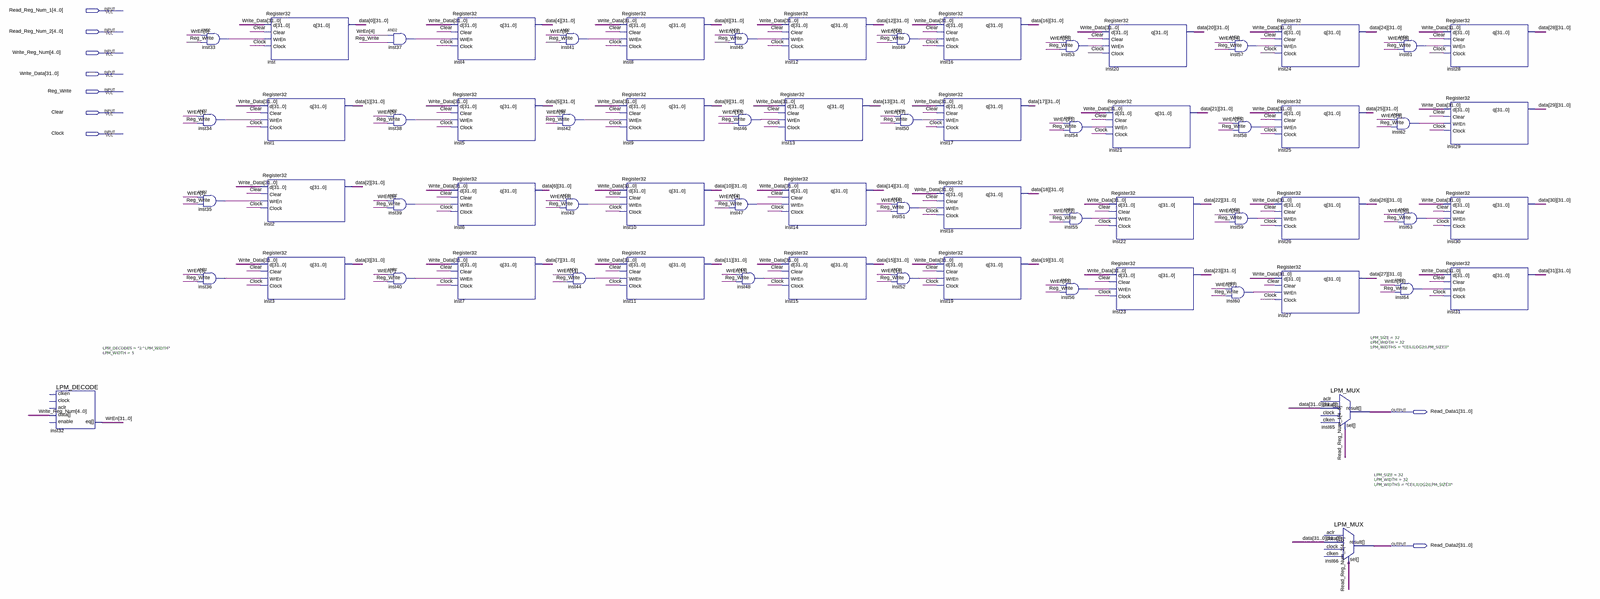
[diagram p0: schematic sheet, whole]
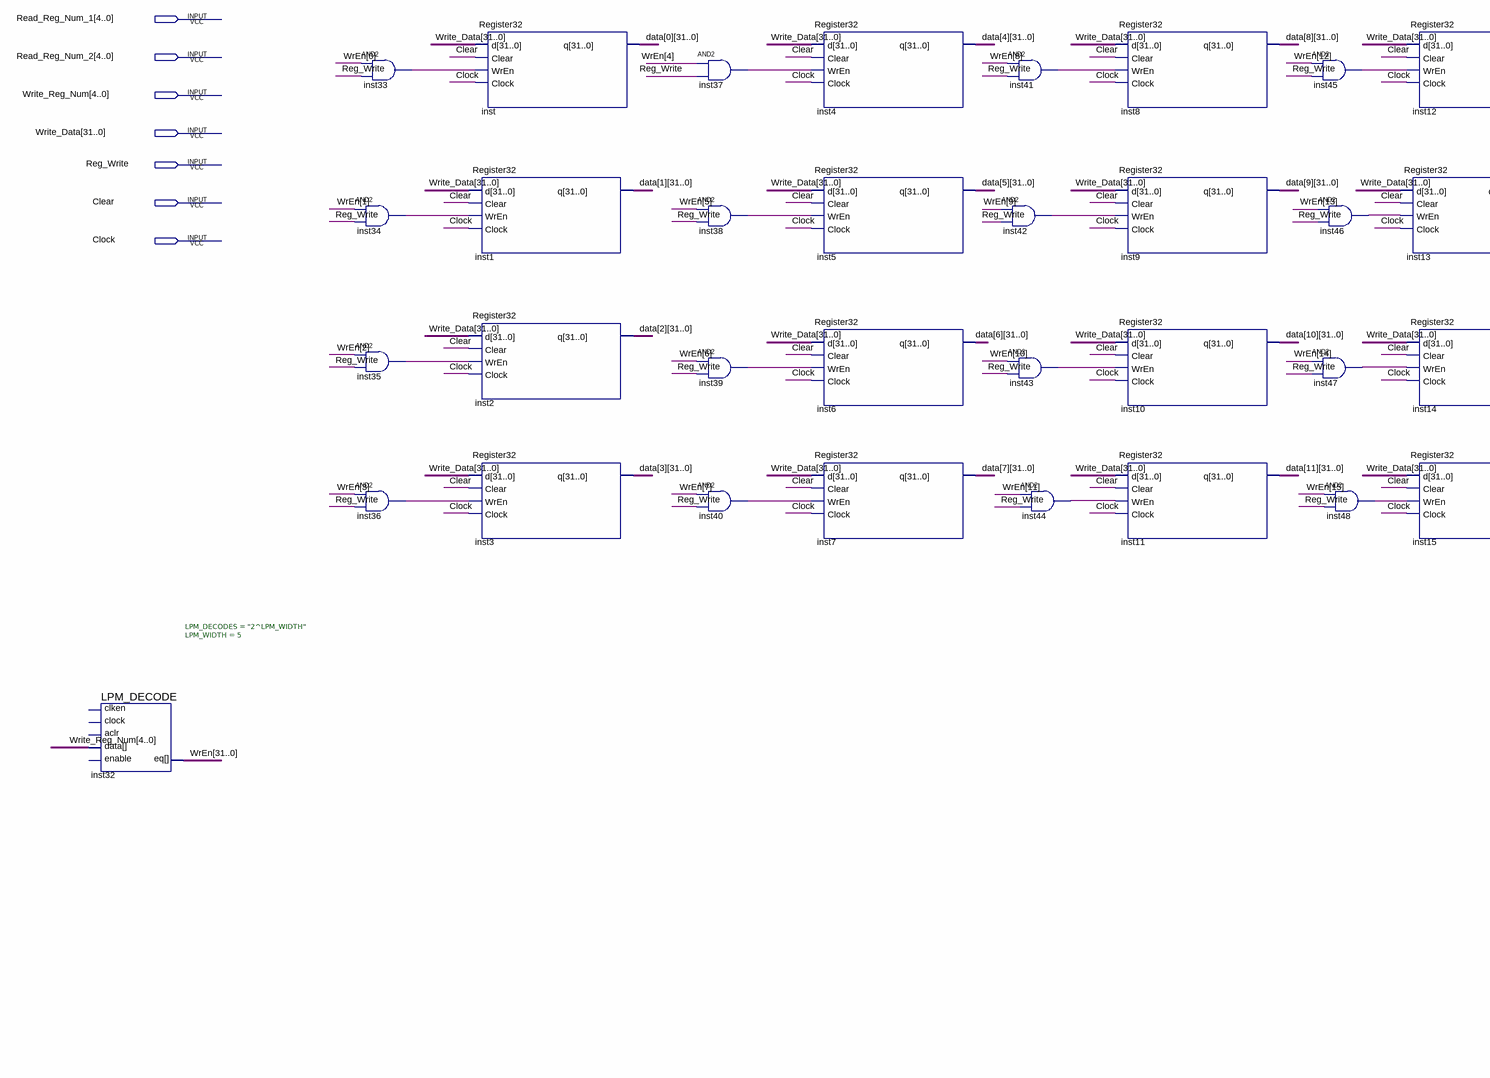
[diagram p1: schematic sheet, left part]
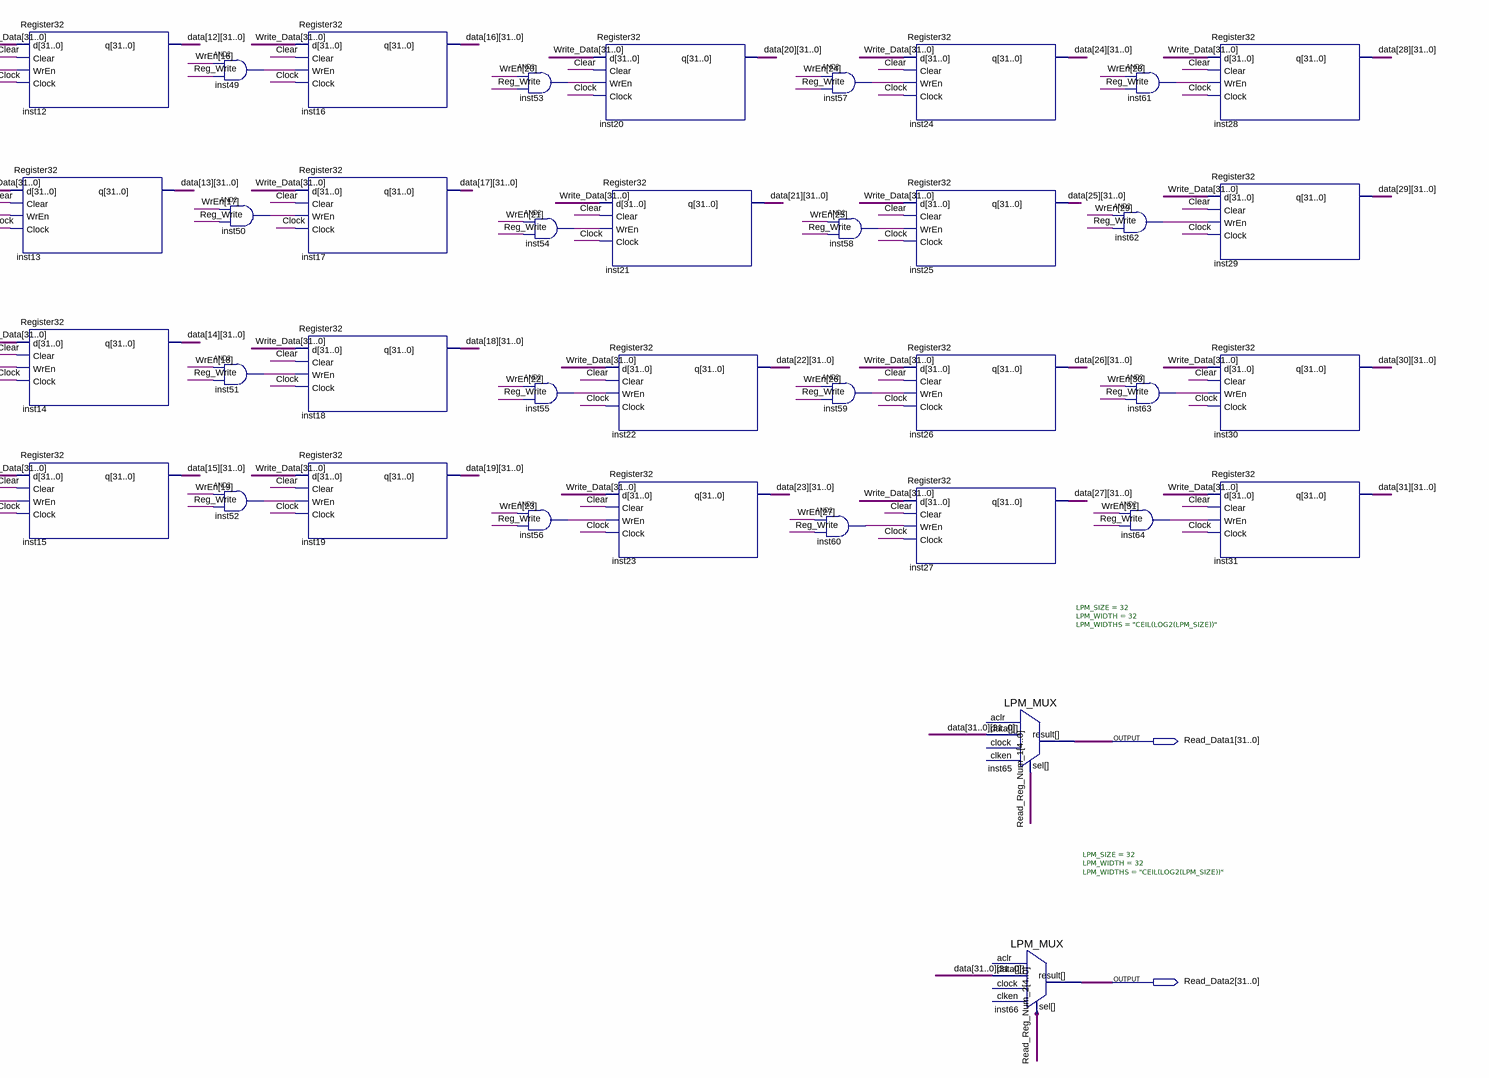
[diagram p2: schematic sheet, right part]
// Quartus schematic MipsRF.bdf as structural Verilog: 67 symbols, 9 pins
module MipsRF (
  input  [4:0] Read_Reg_Num_1,
  input  [4:0] Read_Reg_Num_2,
  input  [4:0] Write_Reg_Num,
  input  [31:0] Write_Data,
  input  Reg_Write,
  input  Clear,
  input  Clock,
  output [31:0] Read_Data1,
  output [31:0] Read_Data2
);

  wire inst33_out, inst34_out, inst35_out, inst36_out, inst37_out, inst38_out, inst39_out, inst40_out,
       inst41_out, inst42_out, inst43_out, inst44_out, inst45_out, inst46_out, inst47_out, inst48_out,
       inst49_out, inst50_out, inst51_out, inst52_out, inst53_out, inst54_out, inst55_out, inst56_out,
       inst57_out, inst58_out, inst59_out, inst60_out, inst61_out, inst62_out, inst63_out, inst64_out;
  wire [31:0] data_0, data_1, data_2, data_3, data_4, data_5, data_6, data_7, data_8, data_9, data_10,
       data_11, data_12, data_13, data_14, data_15, data_16, data_17, data_18, data_19, data_20, data_21,
       data_22, data_23, data_24, data_25, data_26, data_27, data_28, data_29, data_30, data_31, WrEn;

  LPM_DECODE #(.LPM_DECODES("2^LPM_WIDTH"), .LPM_WIDTH(5)) inst32 (
    .data(Write_Reg_Num), .eq(WrEn));  // open: enable, clken, clock, aclr
  and inst33 (inst33_out, WrEn[0], Reg_Write);
  and inst34 (inst34_out, WrEn[1], Reg_Write);
  and inst35 (inst35_out, WrEn[2], Reg_Write);
  and inst36 (inst36_out, WrEn[3], Reg_Write);
  Register32 inst (.d(Write_Data), .Clear(Clear), .WrEn(inst33_out), .Clock(Clock), .q(data_0));
  Register32 inst1 (.d(Write_Data), .Clear(Clear), .WrEn(inst34_out), .Clock(Clock), .q(data_1));
  Register32 inst2 (.d(Write_Data), .Clear(Clear), .WrEn(inst35_out), .Clock(Clock), .q(data_2));
  Register32 inst3 (.d(Write_Data), .Clear(Clear), .WrEn(inst36_out), .Clock(Clock), .q(data_3));
  and inst37 (inst37_out, WrEn[4], Reg_Write);
  and inst38 (inst38_out, WrEn[5], Reg_Write);
  and inst39 (inst39_out, WrEn[6], Reg_Write);
  and inst40 (inst40_out, WrEn[7], Reg_Write);
  Register32 inst4 (.d(Write_Data), .Clear(Clear), .WrEn(inst37_out), .Clock(Clock), .q(data_4));
  Register32 inst5 (.d(Write_Data), .Clear(Clear), .WrEn(inst38_out), .Clock(Clock), .q(data_5));
  Register32 inst6 (.d(Write_Data), .Clear(Clear), .WrEn(inst39_out), .Clock(Clock), .q(data_6));
  Register32 inst7 (.d(Write_Data), .Clear(Clear), .WrEn(inst40_out), .Clock(Clock), .q(data_7));
  and inst42 (inst42_out, WrEn[9], Reg_Write);
  and inst41 (inst41_out, WrEn[8], Reg_Write);
  and inst43 (inst43_out, WrEn[10], Reg_Write);
  and inst44 (inst44_out, WrEn[11], Reg_Write);
  Register32 inst8 (.d(Write_Data), .Clear(Clear), .WrEn(inst41_out), .Clock(Clock), .q(data_8));
  Register32 inst9 (.d(Write_Data), .Clear(Clear), .WrEn(inst42_out), .Clock(Clock), .q(data_9));
  Register32 inst10 (.d(Write_Data), .Clear(Clear), .WrEn(inst43_out), .Clock(Clock), .q(data_10));
  Register32 inst11 (.d(Write_Data), .Clear(Clear), .WrEn(inst44_out), .Clock(Clock), .q(data_11));
  and inst45 (inst45_out, WrEn[12], Reg_Write);
  and inst46 (inst46_out, WrEn[13], Reg_Write);
  and inst47 (inst47_out, WrEn[14], Reg_Write);
  and inst48 (inst48_out, WrEn[15], Reg_Write);
  Register32 inst12 (.d(Write_Data), .Clear(Clear), .WrEn(inst45_out), .Clock(Clock), .q(data_12));
  Register32 inst13 (.d(Write_Data), .Clear(Clear), .WrEn(inst46_out), .Clock(Clock), .q(data_13));
  Register32 inst14 (.d(Write_Data), .Clear(Clear), .WrEn(inst47_out), .Clock(Clock), .q(data_14));
  Register32 inst15 (.d(Write_Data), .Clear(Clear), .WrEn(inst48_out), .Clock(Clock), .q(data_15));
  and inst49 (inst49_out, WrEn[16], Reg_Write);
  and inst50 (inst50_out, WrEn[17], Reg_Write);
  and inst51 (inst51_out, WrEn[18], Reg_Write);
  and inst52 (inst52_out, WrEn[19], Reg_Write);
  Register32 inst16 (.d(Write_Data), .Clear(Clear), .WrEn(inst49_out), .Clock(Clock), .q(data_16));
  Register32 inst17 (.d(Write_Data), .Clear(Clear), .WrEn(inst50_out), .Clock(Clock), .q(data_17));
  Register32 inst18 (.d(Write_Data), .Clear(Clear), .WrEn(inst51_out), .Clock(Clock), .q(data_18));
  Register32 inst19 (.d(Write_Data), .Clear(Clear), .WrEn(inst52_out), .Clock(Clock), .q(data_19));
  and inst53 (inst53_out, WrEn[20], Reg_Write);
  and inst54 (inst54_out, WrEn[21], Reg_Write);
  and inst55 (inst55_out, WrEn[22], Reg_Write);
  and inst56 (inst56_out, WrEn[23], Reg_Write);
  Register32 inst20 (.d(Write_Data), .Clear(Clear), .WrEn(inst53_out), .Clock(Clock), .q(data_20));
  Register32 inst21 (.d(Write_Data), .Clear(Clear), .WrEn(inst54_out), .Clock(Clock), .q(data_21));
  Register32 inst22 (.d(Write_Data), .Clear(Clear), .WrEn(inst55_out), .Clock(Clock), .q(data_22));
  Register32 inst23 (.d(Write_Data), .Clear(Clear), .WrEn(inst56_out), .Clock(Clock), .q(data_23));
  and inst57 (inst57_out, WrEn[24], Reg_Write);
  and inst58 (inst58_out, WrEn[25], Reg_Write);
  and inst59 (inst59_out, WrEn[26], Reg_Write);
  and inst60 (inst60_out, WrEn[27], Reg_Write);
  Register32 inst24 (.d(Write_Data), .Clear(Clear), .WrEn(inst57_out), .Clock(Clock), .q(data_24));
  Register32 inst25 (.d(Write_Data), .Clear(Clear), .WrEn(inst58_out), .Clock(Clock), .q(data_25));
  Register32 inst26 (.d(Write_Data), .Clear(Clear), .WrEn(inst59_out), .Clock(Clock), .q(data_26));
  Register32 inst27 (.d(Write_Data), .Clear(Clear), .WrEn(inst60_out), .Clock(Clock), .q(data_27));
  LPM_MUX #(.LPM_SIZE(32), .LPM_WIDTH(32), .LPM_WIDTHS("CEIL(LOG2(LPM_SIZE))")) inst65 (
    .data({data_31, data_30, data_29, data_28, data_27, data_26, data_25, data_24, data_23, data_22, data_21, data_20, data_19, data_18, data_17, data_16, data_15, data_14, data_13, data_12, data_11, data_10, data_9, data_8, data_7, data_6, data_5, data_4, data_3, data_2, data_1, data_0}),
    .sel(Read_Reg_Num_1), .result(Read_Data1));  // open: clock, aclr, clken
  LPM_MUX #(.LPM_SIZE(32), .LPM_WIDTH(32), .LPM_WIDTHS("CEIL(LOG2(LPM_SIZE))")) inst66 (
    .data({data_31, data_30, data_29, data_28, data_27, data_26, data_25, data_24, data_23, data_22, data_21, data_20, data_19, data_18, data_17, data_16, data_15, data_14, data_13, data_12, data_11, data_10, data_9, data_8, data_7, data_6, data_5, data_4, data_3, data_2, data_1, data_0}),
    .sel(Read_Reg_Num_2), .result(Read_Data2));  // open: clock, aclr, clken
  and inst61 (inst61_out, WrEn[28], Reg_Write);
  and inst62 (inst62_out, WrEn[29], Reg_Write);
  and inst63 (inst63_out, WrEn[30], Reg_Write);
  and inst64 (inst64_out, WrEn[31], Reg_Write);
  Register32 inst28 (.d(Write_Data), .Clear(Clear), .WrEn(inst61_out), .Clock(Clock), .q(data_28));
  Register32 inst29 (.d(Write_Data), .Clear(Clear), .WrEn(inst62_out), .Clock(Clock), .q(data_29));
  Register32 inst30 (.d(Write_Data), .Clear(Clear), .WrEn(inst63_out), .Clock(Clock), .q(data_30));
  Register32 inst31 (.d(Write_Data), .Clear(Clear), .WrEn(inst64_out), .Clock(Clock), .q(data_31));
endmodule
